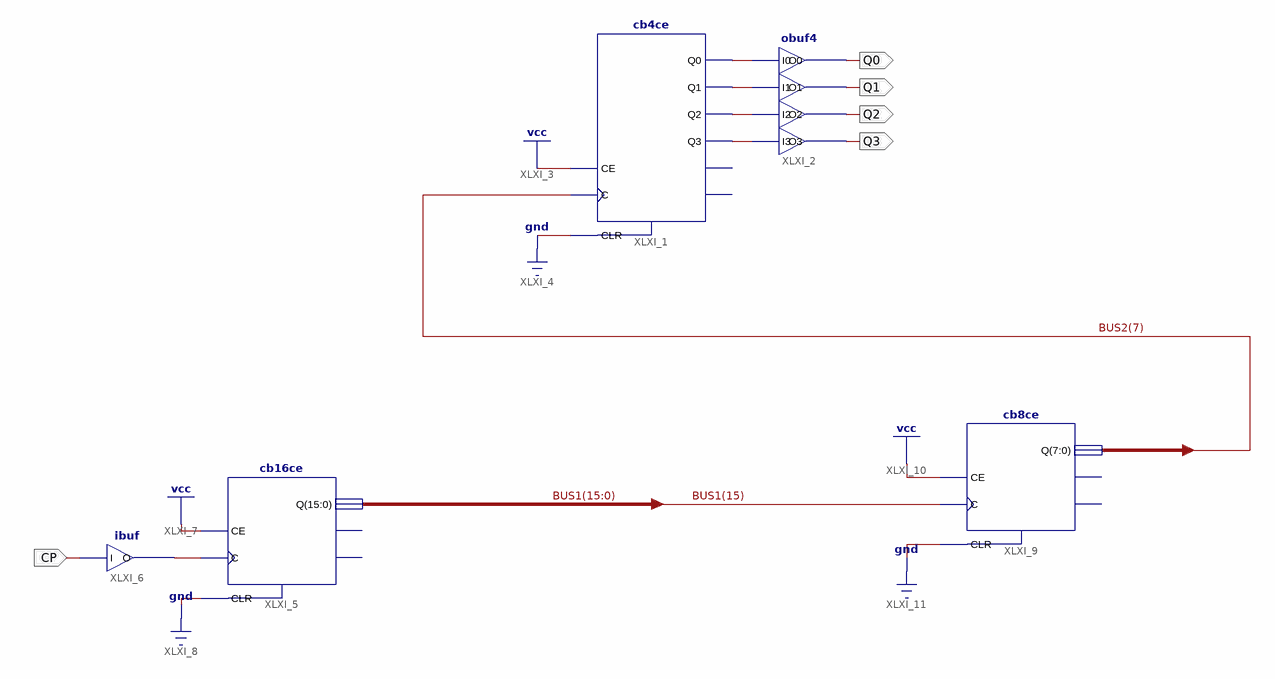
[diagram p0: schematic sheet 1]
// Xilinx ISE schematic T5.sch (spartan3) as structural Verilog: 5 symbols, 5 ports
module T5 (
  input  CP,
  output Q0,
  output Q1,
  output Q2,
  output Q3
);

  wire XLXN_2, XLXN_3, XLXN_4, XLXN_5, XLXN_25;
  wire [7:0] BUS2;
  wire [15:0] BUS1;

  cb4ce XLXI_1 (
    .C(BUS2[7]), .CE(1'b1), .CLR(1'b0), .Q0(XLXN_2), .Q1(XLXN_3), .Q2(XLXN_4), .Q3(XLXN_5));  // open: CEO, TC
  obuf4 XLXI_2 (.I0(XLXN_2), .I1(XLXN_3), .I2(XLXN_4), .I3(XLXN_5), .O0(Q0), .O1(Q1), .O2(Q2), .O3(Q3));
  cb16ce XLXI_5 (.C(XLXN_25), .CE(1'b1), .CLR(1'b0), .Q(BUS1));  // open: CEO, TC
  ibuf XLXI_6 (.I(CP), .O(XLXN_25));
  cb8ce XLXI_9 (.C(BUS1[15]), .CE(1'b1), .CLR(1'b0), .Q(BUS2));  // open: CEO, TC
endmodule
